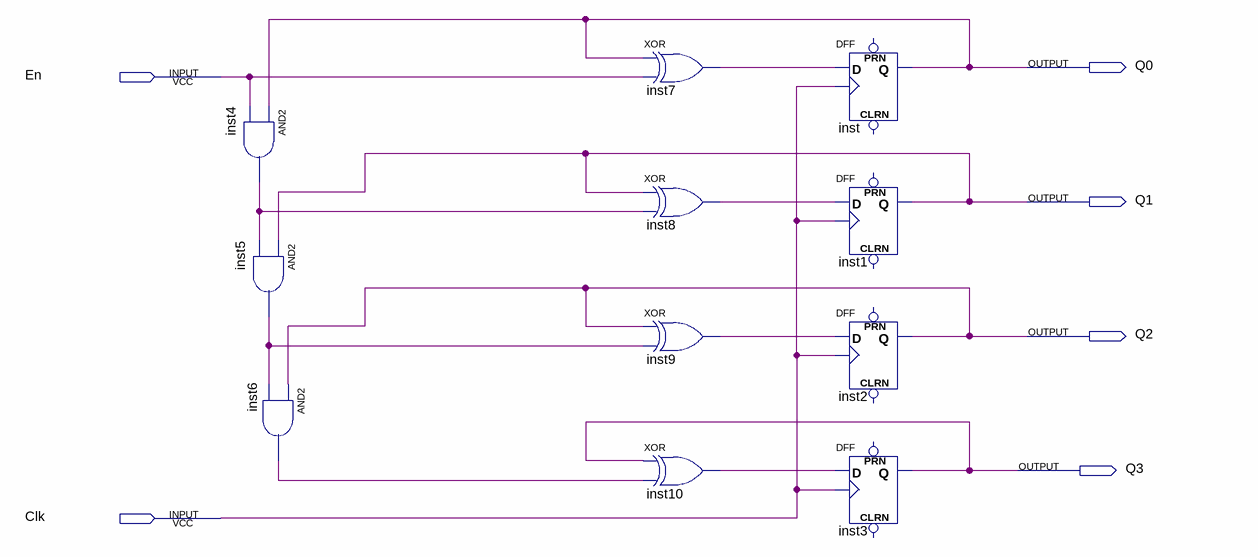
[diagram p0: schematic sheet]
// Quartus schematic lab10step2a.bdf as structural Verilog: 11 symbols, 6 pins
module lab10step2a (
  input  En,
  input  Clk,
  output Q0,
  output Q1,
  output Q2,
  output Q3
);

  wire inst4_out, inst5_out, inst6_out, inst7_out, inst8_out, inst9_out, inst10_out;

  and inst4 (inst4_out, Q0, En);
  and inst5 (inst5_out, Q1, inst4_out);
  and inst6 (inst6_out, Q2, inst5_out);
  xor inst7 (inst7_out, Q0, En);
  xor inst8 (inst8_out, Q1, inst4_out);
  xor inst9 (inst9_out, Q2, inst5_out);
  xor inst10 (inst10_out, Q3, inst6_out);
  DFF inst (.CLK(Clk), .D(inst7_out), .Q(Q0));  // open: CLRN, PRN
  DFF inst1 (.CLK(Clk), .D(inst8_out), .Q(Q1));  // open: CLRN, PRN
  DFF inst2 (.CLK(Clk), .D(inst9_out), .Q(Q2));  // open: CLRN, PRN
  DFF inst3 (.CLK(Clk), .D(inst10_out), .Q(Q3));  // open: CLRN, PRN
endmodule
